# Altium schematic sheet 02.Power.SchDoc
size A4; Author: 刘时杰; CompanyName: 广州致远电子有限公司; DocumentNumber: 2; SheetNumber: 2; SheetTotal: 8; PageSetup: Record=PageOptions|CenterHorizontal=True|CenterVertical=True|PrintScale=1.00|XCorrection=1.00|YCorrection=1.00|PrintKind=0|BorderSize=5000000|LeftOffset=0|BottomOffset=0|Orientation=2|PaperLength=1000|PaperWidth=1000|Scale=100|PaperSource=7|PrintQuality=600|MediaType=1|DitherType=10|PaperKind=A4|PrintScaleMode=1; DesignDate: 20180913; CheckDate: 20180913; SheetName: POWER; SheetVersion: V1.00; SheetDescription: AML166评估板电源电路
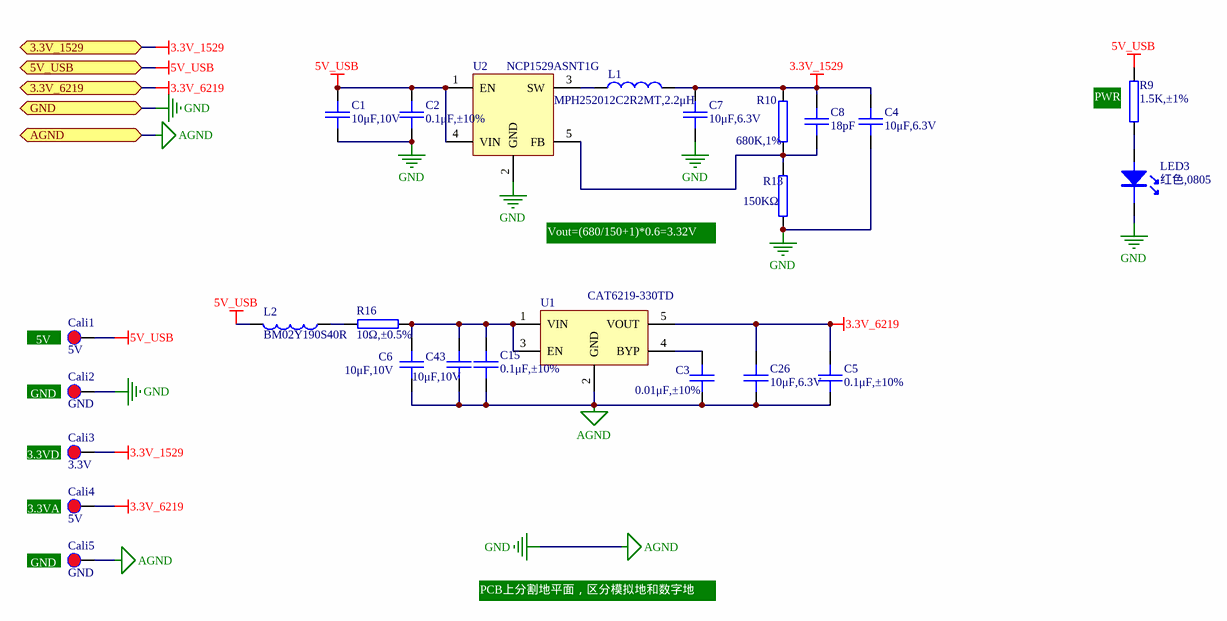
[diagram p0: 02.Power.SchDoc]

## Parts
C1  10μF,10V  [0805C]
C2  0.1μF,±10%  [0402C]
C3  0.01μF,±10%  [0402C]
C4  10μF,6.3V  [0603C]
C5  0.1μF,±10%  [0402C]
C6  10μF,10V  [0805C]
C7  10μF,6.3V  [0603C]
C8  18pF  [0402C]
C15  0.1μF,±10%  [0402C]
C26  10μF,6.3V  [0603C]
C43  10μF,10V  [0805C]
Cali1  5V  [PAD-25/40]  (no BOM)
Cali2  GND  [PAD-25/40]  (no BOM)
Cali3  3.3V  [PAD-25/40]  (no BOM)
Cali4  5V  [PAD-25/40]  (no BOM)
Cali5  GND  [PAD-25/40]  (no BOM)
L1  MPH252012C2R2MT,2.2μH  [INDC2520X10N]
L2  BM02Y190S40R  [0402RL]
LED3  value 红色,0805  [LED-0805]  (hidden comment: LED1)
R9  1.5K,±1%  [0402R]
R10  680K,1%  [0402R]
R13  150KΩ  [0603R]
R16  10Ω,±0.5%  [0402R]
U1  CAT6219-330TD  [SOT-23-5]
U2  NCP1529ASNT1G  [SOT-23-5]

## Ports
3.3V_1529, 3.3V_6219, 5V_USB, AGND, GND

## Nets
3.3V_1529: C4.1 C7.1 C8.1 Cali3.1 L1.2 R10.2 ; port 3.3V_1529
3.3V_6219: C5.1 C26.1 Cali4.1 U1.5(VOUT) ; port 3.3V_6219
5V_USB: C1.1 C2.1 Cali1.1 L2.2 R9.2 U2.1(EN) U2.4(VIN) ; port 5V_USB
AGND: C1.2 C2.2 C3.2 C4.2 C5.2 C6.2 C7.2 C15.2 C26.2 C43.2 Cali2.1 Cali5.1 LED3.2 R13.1 U1.2(GND) U2.2(GND) ; port GND, port AGND  [also labelled GND]
NetC3_1: C3.1 U1.4(BYP)
NetC6_1: C6.1 C15.1 C43.1 R16.2 U1.1(VIN) U1.3(EN)
NetC8_2: C8.2 R10.1 R13.2 U2.5(FB)
NetL1_1: L1.1 U2.3(SW)
NetL2_1: L2.1 R16.1
NetLED3_1: LED3.1 R9.1

## Notes on the sheet
- (near R9) PWR
- Vout=(680/150+1)*0.6=3.32V
- (near Cali1) 5V
- (near Cali2) GND
- (near Cali3) 3.3VD
- (near Cali4) 3.3VA
- (near Cali5) GND
- PCB上分割地平面，区分模拟地和数字地
- 1
- #
- 修改日期
- 修改内容
- 2
- 3
- 设计人员
- 审核人员
- 设计日期
- 审核日期
- 产品名称
- 图纸名称
- 产品型号
- 图纸描述
- 图纸版本
- A4

## Library data of the parts
C1 C6 C43 = 1.02.02.0117: 10μF,±10%,10V,X7R,GRM21BR71A106KE51L,0805,muRata,RoHS; 名称: 电容; 封装: 0805; 贴片和直插: SMT; PCB备注: 171017lmd; 器件优选方案: 正常状态，可以选用; 物料代码: 1.02.02.0117; Value: 10μF,10V; 厂商: muRata; RoHS: RoHS; 型号: 10μF,±10%,10V,X7R,GRM21BR71A106KE51L; ComponentLink1Description: ErpDataInfo; ComponentLink1URL: http://erp.zlgmcu.com/ErpExt/ErpData/ListMateriel.aspx?pkey=1.02.02.0117
C2 C5 C15 = 1.02.17.0006: GRM155R71C104KA88D,0.1μF,±10%,16V,X7R,0402,muRata,RoHS; 名称: 电容; 封装: 0402; 设备封装名称: C0402_0.1uF_X7R_16V_10%; 贴片和直插: SMT; 器件优选方案: 正常状态，可以选用; 物料代码: 1.02.17.0006; Value: 0.1μF,±10%; 厂商: muRata; RoHS: RoHS; 型号: 0.1μF,±10%,16V,X7R; ComponentLink1Description: ErpDataInfo; ComponentLink1URL: http://erp.zlgmcu.com/ErpExt/ErpData/ListMateriel.aspx?pkey=1.02.17.0006
C3 = 1.02.17.0019: GRM155R71H103KA88D,0.01μF,±10%,50V,X7R,0402,muRata,RoHS; 名称: 电容; 封装: 0402; 设备封装名称: C0402_0.01uF_X7R_50V_10%; 贴片和直插: SMT; 器件优选方案: 正常状态，可以选用; 物料代码: 1.02.17.0019; Value: 0.01μF,±10%; 厂商: muRata; RoHS: RoHS; 型号: 0.01μF,±10%,50V,X7R; ComponentLink1Description: ErpDataInfo; ComponentLink1URL: http://erp.zlgmcu.com/ErpExt/ErpData/ListMateriel.aspx?pkey=1.02.17.0019
C4 C7 C26 = 1.02.01.0065: 10μF,6.3V,X5R,GRM188R60J106M****,0603,Murata,RoHS; 名称: 电容; 封装: 0603; 贴片和直插: SMT; 器件优选方案: 正常状态，可以选用; 物料代码: 1.02.01.0065; Value: 10μF,6.3V; 厂商: muRata; RoHS: RoHS; 型号: 10μF,6.3V,X5R,GRM188R60J106M****; ComponentLink1Description: ErpDataInfo; ComponentLink1URL: http://erp.zlgmcu.com/ErpExt/ErpData/ListMateriel.aspx?pkey=1.02.01.0065
C8 = 1.02.17.0078: GRM1555C1H180JA01D,18pF,±5%,50V,C0G,0402,muRata,RoHS; 名称: 电容; 封装: 0402; 贴片和直插: SMT; 器件优选方案: 正常状态，可以选用; 物料代码: 1.02.17.0078; Value: 18pF; 厂商: muRata; RoHS: RoHS; 型号: GRM1555C1H180JA01D,18pF,±5%,50V,C0G; ComponentLink1Description: ErpDataInfo; ComponentLink1URL: http://erp.zlgmcu.com/ErpExt/ErpData/ListMateriel.aspx?pkey=1.02.17.0078
Cali1-Cali5 = TEST-DOT
L1 = 1.03.01.0347: MPH252012C2R2MT,2.2μH,±20%,700mA,1008,Sunlord,RoHs; 名称: 电感; 封装: 1008; 贴片和直插: SMT; PCB备注: 160722ZW   160729toPCB-hcj; 器件优选方案: 正常状态，可以选用; 物料代码: 1.03.01.0347; Value: MPH252012C2R2MT,2.2μH; 厂商: Sunlord; RoHS: RoHS; 型号: MPH252012C2R2MT,2.2μH,±20%,700mA; ComponentLink1Description: ErpDataInfo; ComponentLink1URL: http://erp.zlgmcu.com/ErpExt/ErpData/ListMateriel.aspx?pkey=1.03.01.0347
L2 = 1.03.03.0022: BM02Y190S40R,0402,丰晶,RoHS; 名称: 磁珠; 封装: 0402; 贴片和直插: SMT; 器件优选方案: 正常状态，可以选用; 物料代码: 1.03.03.0022; Value: BM02Y190S40R; 厂商: 丰晶; RoHS: RoHS; 型号: BM02Y190S40R; ComponentLink1Description: ErpDataInfo; ComponentLink1URL: http://erp.zlgmcu.com/ErpExt/ErpData/ListMateriel.aspx?pkey=1.03.03.0022
LED3 = 1.04.05.0001: 红色,0805,0805,RoHS; 名称: 发光二极管; 封装: 0805; 设备封装名称: LED0805-RED; 贴片和直插: SMT; 器件优选方案: 样品物料,谨慎选用; 物料代码: 1.04.05.0001; RoHS: RoHS; 型号: 红色,0805; ComponentLink1Description: ErpDataInfo; ComponentLink1URL: http://erp.zlgmcu.com/ErpExt/ErpData/ListMateriel.aspx?pkey=1.04.05.0001
R9 = 1.01.17.0011: 1.5K,±1%,0402,RALEC,RoHS; 名称: 电阻; 封装: 0402; 设备封装名称: R0402_1.5K_1%; 贴片和直插: SMT; 器件优选方案: 正常状态，可以选用; 物料代码: 1.01.17.0011; Value: 1.5K,±1%; 厂商: Ralec; RoHS: RoHS; 型号: 1.5K,±1%; ComponentLink1Description: ErpDataInfo; ComponentLink1URL: http://erp.zlgmcu.com/ErpExt/ErpData/ListMateriel.aspx?pkey=1.01.17.0011
R10 = 1.01.17.0086: 680K,1%,0402,Ralec,RoHS; 名称: 电阻; 封装: 0402; 贴片和直插: SMT; 器件优选方案: 正常状态，可以选用; 物料代码: 1.01.17.0086; Value: 680K,1%; 厂商: Ralec; RoHS: RoHS; 型号: 680K,1%; ComponentLink1Description: ErpDataInfo; ComponentLink1URL: http://erp.zlgmcu.com/ErpExt/ErpData/ListMateriel.aspx?pkey=1.01.17.0086
R13 = 1.01.01.0065: 150KΩ,0603,*,RoHS; 名称: 电阻; 封装: 0603; 设备封装名称: R0603_150K; 厂商: Ralec; 贴片和直插: SMT; 器件优选方案: 正常状态，可以选用; 物料代码: 1.01.01.0065; Value: 150KΩ; RoHS: RoHS; 型号: 150KΩ; ComponentLink1Description: ErpDataInfo; ComponentLink1URL: http://erp.zlgmcu.com/ErpExt/ErpData/ListMateriel.aspx?pkey=1.01.01.0065
R16 = 1.01.17.0049: 10Ω,±0.5%,0402,RoHS; 名称: 电阻; 封装: 0402; 设备封装名称: R0402_10R_0.5%; 厂商: Ralec; 贴片和直插: SMT; 器件优选方案: 正常状态，可以选用; 物料代码: 1.01.17.0049; Value: 10Ω,±0.5%; RoHS: RoHS; 型号: 10Ω,±0.5%; ComponentLink1Description: ErpDataInfo; ComponentLink1URL: http://erp.zlgmcu.com/ErpExt/ErpData/ListMateriel.aspx?pkey=1.01.17.0049
U1 = 1.05.10.0321: CAT6219-330TD,TSOT-23-5,ON,RoHS; 名称: 集成电路; 设备封装名称: TSOT-23-5_CAT6219-330TD-GT3; 贴片和直插: SMT; 器件优选方案: 量产物料,优先选用; 物料代码: 1.05.10.0321; Value: CAT6219-330TD; 封装: TSOT-23-5; 厂商: ON; RoHS: RoHS; 型号: CAT6219-330TD; ComponentLink1Description: ErpDataInfo; ComponentLink1URL: http://erp.zlgmcu.com/ErpExt/ErpData/ListMateriel.aspx?pkey=1.05.10.0321
U2 = 1.05.09.0091: NCP1529ASNT1G,TSOP-5,ON,RoHS; 名称: 集成电路; 设备封装名称: TSOP-5_NCP1529ASNT1G; 贴片和直插: SMT; 器件优选方案: 量产物料,优先选用; 物料代码: 1.05.09.0091; Value: NCP1529ASNT1G; 封装: TSOP-5; 厂商: ON; RoHS: RoHS; 型号: NCP1529ASNT1G; ComponentLink1Description: ErpDataInfo; ComponentLink1URL: http://erp.zlgmcu.com/ErpExt/ErpData/ListMateriel.aspx?pkey=1.05.09.0091